# EAGLE design M002X (EAGLE 6.6.0)
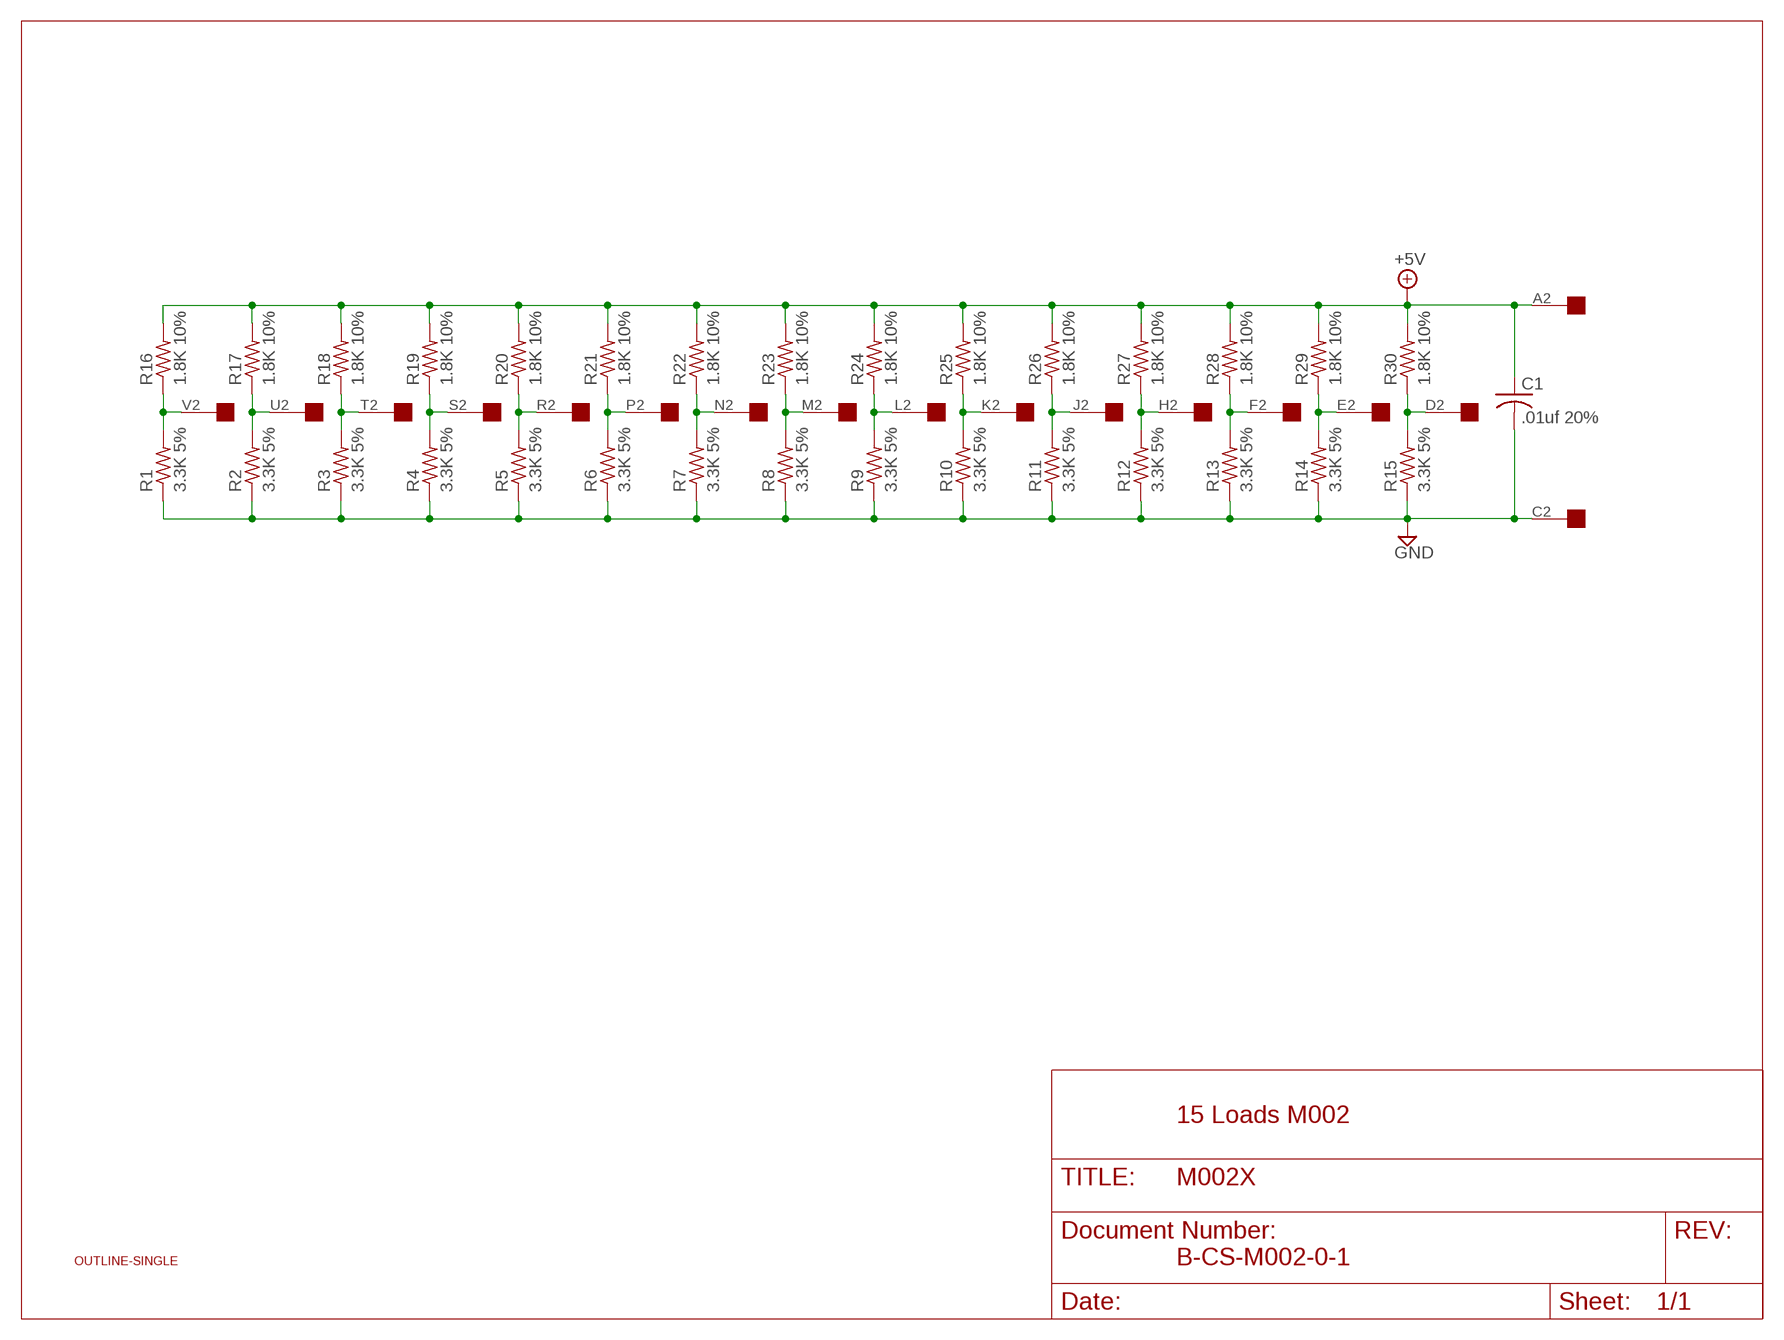
[diagram p0: schematic, sheet 1]

## Parts
C1  .01uf 20%  C-US050-025X075  [C050-025X075]
R1  3.3K 5%  R-US_0207/10  [0207/10]
R2  3.3K 5%  R-US_0207/10  [0207/10]
R3  3.3K 5%  R-US_0207/10  [0207/10]
R4  3.3K 5%  R-US_0207/10  [0207/10]
R5  3.3K 5%  R-US_0207/10  [0207/10]
R6  3.3K 5%  R-US_0207/10  [0207/10]
R7  3.3K 5%  R-US_0207/10  [0207/10]
R8  3.3K 5%  R-US_0207/10  [0207/10]
R9  3.3K 5%  R-US_0207/10  [0207/10]
R10  3.3K 5%  R-US_0207/10  [0207/10]
R11  3.3K 5%  R-US_0207/10  [0207/10]
R12  3.3K 5%  R-US_0207/10  [0207/10]
R13  3.3K 5%  R-US_0207/10  [0207/10]
R14  3.3K 5%  R-US_0207/10  [0207/10]
R15  3.3K 5%  R-US_0207/10  [0207/10]
R16  1.8K 10%  R-US_0207/10  [0207/10]
R17  1.8K 10%  R-US_0207/10  [0207/10]
R18  1.8K 10%  R-US_0207/10  [0207/10]
R19  1.8K 10%  R-US_0207/10  [0207/10]
R20  1.8K 10%  R-US_0207/10  [0207/10]
R21  1.8K 10%  R-US_0207/10  [0207/10]
R22  1.8K 10%  R-US_0207/10  [0207/10]
R23  1.8K 10%  R-US_0207/10  [0207/10]
R24  1.8K 10%  R-US_0207/10  [0207/10]
R25  1.8K 10%  R-US_0207/10  [0207/10]
R26  1.8K 10%  R-US_0207/10  [0207/10]
R27  1.8K 10%  R-US_0207/10  [0207/10]
R28  1.8K 10%  R-US_0207/10  [0207/10]
R29  1.8K 10%  R-US_0207/10  [0207/10]
R30  1.8K 10%  R-US_0207/10  [0207/10]
U$1  OUTLINE-SINGLE  [SINGLE]
U$2  EDGE-1  [EDGE-CON1]

## Nets
+5V [Supply]: C1.1 R16.2 R17.2 R18.2 R19.2 R20.2 R21.2 R22.2 R23.2 R24.2 R25.2 R26.2 R27.2 R28.2 R29.2 R30.2 U$2.A2
GND [Supply]: C1.2 R1.1 R2.1 R3.1 R4.1 R5.1 R6.1 R7.1 R8.1 R9.1 R10.1 R11.1 R12.1 R13.1 R14.1 R15.1 U$2.C2
N$1: R1.2 R16.1 U$2.V2
N$2: R2.2 R17.1 U$2.U2
N$3: R3.2 R18.1 U$2.T2
N$4: R4.2 R19.1 U$2.S2
N$5: R5.2 R20.1 U$2.R2
N$6: R6.2 R21.1 U$2.P2
N$7: R7.2 R22.1 U$2.N2
N$8: R8.2 R23.1 U$2.M2
N$9: R9.2 R24.1 U$2.L2
N$10: R10.2 R25.1 U$2.K2
N$11: R11.2 R26.1 U$2.J2
N$12: R12.2 R27.1 U$2.H2
N$13: R13.2 R28.1 U$2.F2
N$14: R15.2 R30.1 U$2.D2
N$15: R14.2 R29.1 U$2.E2
Unconnected: U$2.B2

## Notes on the sheet
- 15 Loads M002
- B-CS-M002-0-1

## Library data of the parts
C1 = rcl:C-US: CAPACITOR, American symbol
R1-R30 = rcl:R-US_: RESISTOR, American symbol
U$1 = dec-con:OUTLINE-*: Board outlines for DEC boards.
U$2 = dec-con:EDGE-1: Single-Sided DEC Edge Connector -- (side 2)

## Net classes
1 Supply: width 0.813 mm

## Board
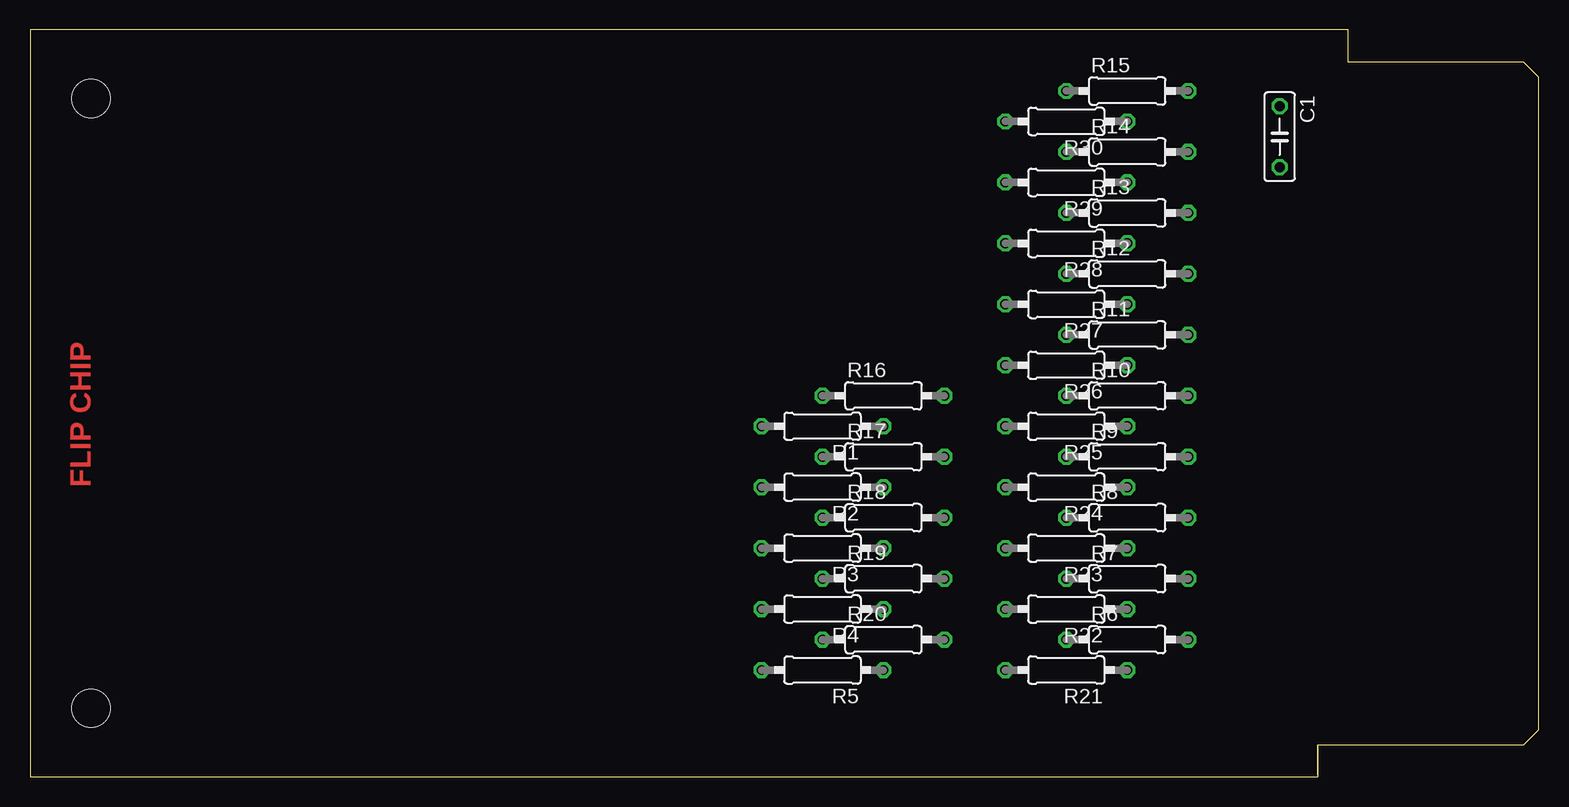
[diagram p1: board, top side]
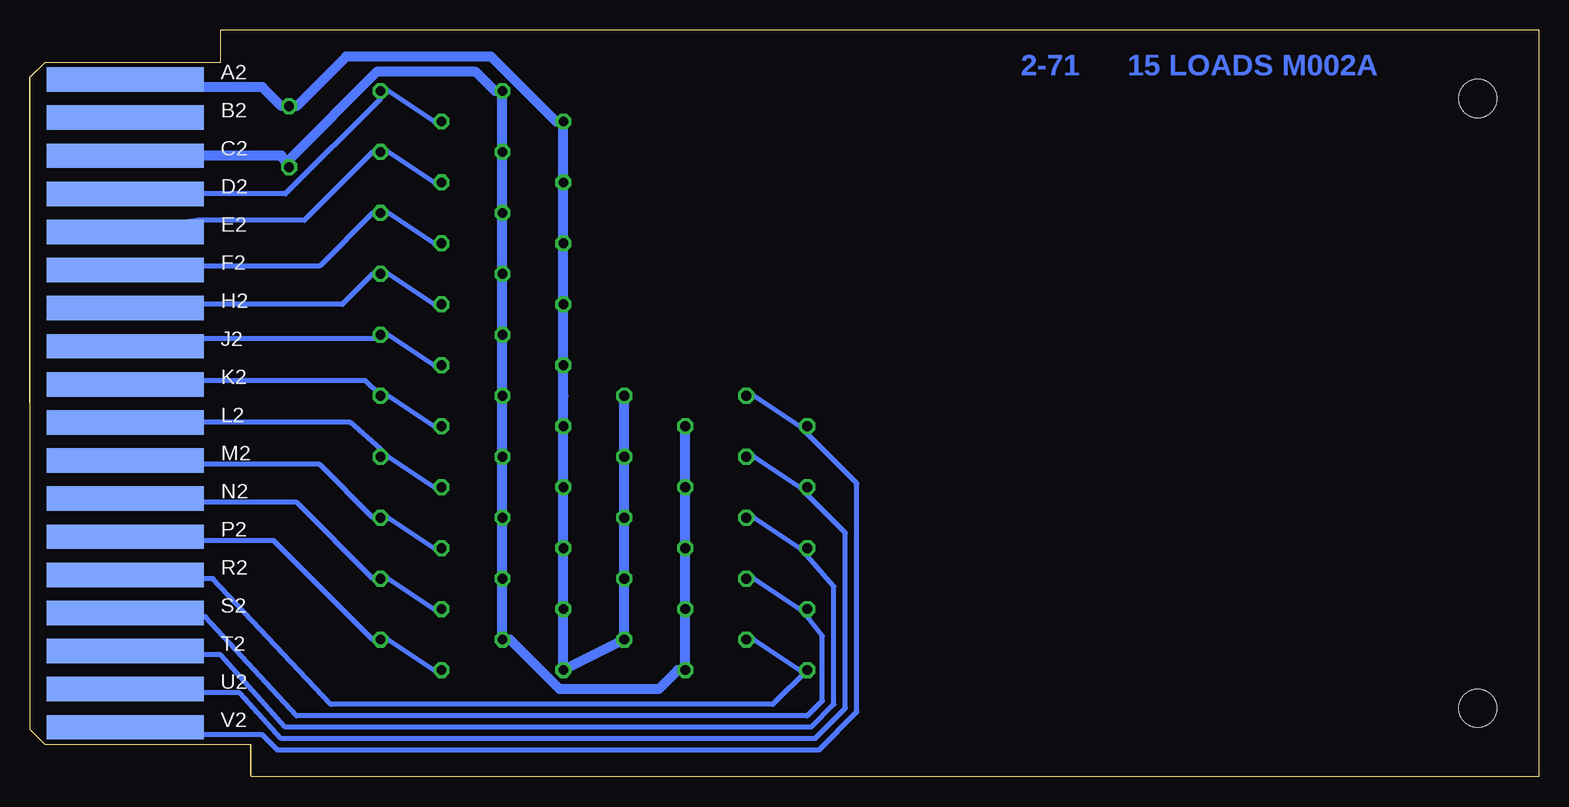
[diagram p2: board, bottom side, seen from below]

Size 125.73 x 62.23 mm. Coordinates in mm from the lower left corner, seen from the top.
Copper layers (1*16): Top 0.035mm / dielectric 1.5mm / Bottom 0.035mm
Design rules "15mils": minimum track width 16mil, minimum drill 24mil, track to track 15mil, track to pad 10mil, pad to pad 10mil, via to via 10mil, smd to smd 10mil, copper to edge 25mil, drill to drill 10mil, minimum pad ring 10mil, minimum via ring 8mil, stop-mask expansion 0mil, vias tented up to drill 0mil, thermal gap 10mil

### Footprints (pad centres in the part's own frame; a part is rotated, then mirrored left to right if it is on the bottom)
C050-025X075 = drill 0.813 octagon: 1 -2.54,0; 2 2.54,0
0207/10 = drill 0.813 octagon: 1 -5.08,0; 2 5.08,0
SINGLE = hole 3.175: 120.65,56.515; 120.65,5.715
EDGE-CON1 = smd 13.106 x 2.032 bottom: A2 7.938,4.128; B2 7.938,7.303; C2 7.938,10.477; D2 7.938,13.652; E2 7.938,16.828; F2 7.938,20.003; H2 7.938,23.177; J2 7.938,26.352; K2 7.938,29.527; L2 7.938,32.703; M2 7.938,35.877; N2 7.938,39.053; P2 7.938,42.227; R2 7.938,45.403; S2 7.938,48.578; T2 7.938,51.752; U2 7.938,54.928; V2 7.938,58.102

### Placement (x,y rotation side)
C1  104.14,53.34 270 top
R1  66.04,29.21 180 top
R2  66.04,24.13 180 top
R3  66.04,19.05 180 top
R4  66.04,13.97 180 top
R5  66.04,8.89 180 top
R6  91.44,11.43 0 top
R7  91.44,16.51 0 top
R8  91.44,21.59 0 top
R9  91.44,26.67 0 top
R10  91.44,31.75 0 top
R11  91.44,36.83 0 top
R12  91.44,41.91 0 top
R13  91.44,46.99 0 top
R14  91.44,52.07 0 top
R15  91.44,57.15 0 top
R16  71.12,31.75 0 top
R17  71.12,26.67 0 top
R18  71.12,21.59 0 top
R19  71.12,16.51 0 top
R20  71.12,11.43 0 top
R21  86.36,8.89 180 top
R22  86.36,13.97 180 top
R23  86.36,19.05 180 top
R24  86.36,24.13 180 top
R25  86.36,29.21 180 top
R26  86.36,34.29 180 top
R27  86.36,39.37 180 top
R28  86.36,44.45 180 top
R29  86.36,49.53 180 top
R30  86.36,54.61 180 top
U$1  125.73,62.23 180 top
U$2  125.73,62.23 180 top

### Tracks (layer width: path | path; a pad name or v marks a point on that pad's centre or on a via)
+5V
  Bottom 0.813: U$2.A2 111.76,57.47 106.36,57.47 104.78,55.88 C1.1 103.5,55.88 99.38,60.01 87.31,60.01 81.92,54.61 R30.2 R29.2 R28.2 R27.2 R26.2 81.28,31.75 R25.2 R24.2 R23.2 R22.2 R21.2 R20.2 R19.2 R18.2 R17.2 R16.2
GND
  Bottom 0.813: U$2.C2 111.76,51.75 104.78,51.75 C1.2 104.14,51.44 96.84,58.74 88.58,58.74 87,57.15 R15.1 R14.1 R13.1 R12.1 R11.1 R10.1 R9.1 R8.1 R7.1 R6.1 85.72,11.43 81.6,7.3 73.34,7.3 71.75,8.89 R5.1 R4.1 R3.1 R2.1 R1.1
N$1
  Bottom 0.406: R16.1 65.41,31.75 61.59,29.21 R1.2 60.96,28.57 56.83,24.45 56.83,5.4 60.01,2.22 105.09,2.22 106.36,3.49 111.76,3.49 U$2.V2
N$2
  Bottom 0.406: R17.1 65.41,26.67 61.59,24.13 R2.2 60.96,23.5 57.78,20.32 57.78,5.71 60.33,3.17 104.78,3.17 108.27,6.99 111.76,6.99 U$2.U2
N$3
  Bottom 0.406: R18.1 65.41,21.59 61.59,19.05 R3.2 60.96,18.41 58.74,15.88 58.74,6.03 60.64,4.13 104.46,4.13 109.86,10.16 111.76,10.16 U$2.T2
N$4
  Bottom 0.406: R19.1 65.41,16.51 61.59,13.97 R4.2 60.96,13.34 59.69,11.75 59.69,6.35 60.96,5.08 103.5,5.08 111.12,13.34 111.76,13.34 U$2.S2
N$5
  Bottom 0.406: R20.1 65.41,11.43 61.59,8.89 R5.2 63.82,6.03 100.65,6.03 110.49,16.51 111.76,16.51 U$2.R2
N$6
  Bottom 0.406: R21.1 92.08,8.89 95.89,11.43 R6.2 97.16,11.43 105.41,19.68 111.76,19.68 U$2.P2
N$7
  Bottom 0.406: R22.1 92.08,13.97 95.89,16.51 R7.2 97.16,16.51 103.5,22.86 111.76,22.86 U$2.N2
N$8
  Bottom 0.406: R23.1 92.08,19.05 95.89,21.59 R8.2 97.16,21.59 101.6,26.04 111.76,26.04 U$2.M2
N$9
  Bottom 0.406: R24.1 92.08,24.13 95.89,26.67 R9.2 96.52,27.3 99.06,29.53 111.76,29.53 U$2.L2
N$10
  Bottom 0.406: R25.1 92.08,29.21 95.89,31.75 R10.2 97.79,33.02 111.76,33.02 U$2.K2
N$11
  Bottom 0.406: R26.1 92.08,34.29 95.89,36.83 R11.2 96.84,36.51 111.76,36.51 U$2.J2
N$12
  Bottom 0.406: R27.1 92.08,39.37 95.89,41.91 R12.2 97.16,41.91 99.69,39.37 111.76,39.37 U$2.H2
N$13
  Bottom 0.406: R28.1 92.08,44.45 95.89,46.99 R13.2 97.16,46.99 101.6,42.55 111.76,42.55 U$2.F2
N$14
  Bottom 0.406: R30.1 92.08,54.61 95.89,57.15 R15.2 96.52,56.52 104.46,48.58 112.71,48.58 U$2.D2
N$15
  Bottom 0.406: R29.1 92.08,49.53 95.89,52.07 R14.2 97.16,52.07 102.87,46.35 111.76,46.35 U$2.E2

### Text on the board
Top: FLIP CHIP
Bottom: 15 LOADS M002A | 2-71